# EAGLE design controllerHat (EAGLE 7.6.0)
CNAME: timebox controller; CREVISION: 1.0; DESIGNER: volzo
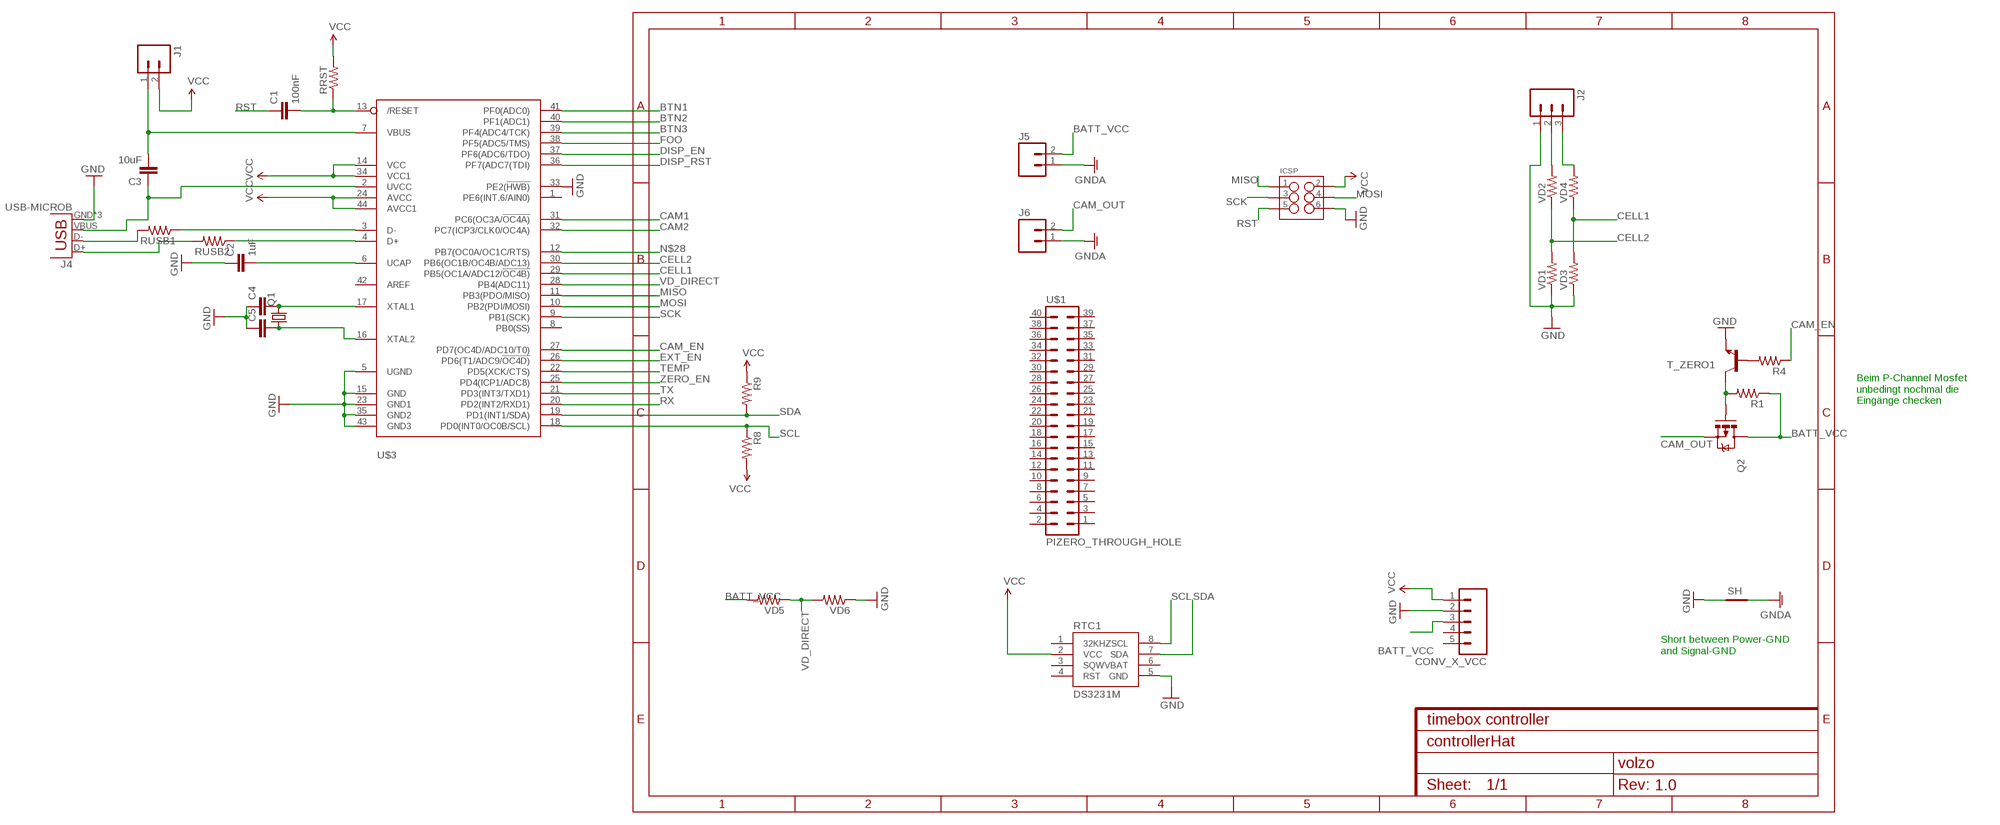
[diagram p0: schematic, sheet 1]

## Parts
C1  100nF  CAP1206  [1206]
C2  1uF  CAP1206  [1206]
C3  10uF  CAP1206  [1206]
C4  CAP1206  [1206]
C5  CAP1206  [1206]
CONV_X_VCC  M05LOCK  [1X05_LOCK]
ICSP  M03X2FEMALE  [2X3]
J1  M02LOCK  [1X02_LOCK]
J2  M03LOCK  [1X03_LOCK]
J4  USB-MICROB  [USB-MICROB]
J5  M023.5MM_LOCK  [SCREWTERMINAL-3.5MM-2_LOCK]
J6  M023.5MM_LOCK  [SCREWTERMINAL-3.5MM-2_LOCK]
Q1  CRYSTALMM20SS  [MM20SS]
Q2  MOSFET-PCHANNELNDP6020P_20V_24A_LOW_VGS_TH  [TO220V]
R1  RESISTOR1206  [1206]
R4  RESISTOR1206  [1206]
R8  RESISTOR1206  [1206]
R9  RESISTOR1206  [1206]
RRST  RESISTOR1206  [1206]
RTC1  DS3231M  [SOIC8]
RUSB1  RESISTOR1206  [1206]
RUSB2  RESISTOR1206  [1206]
SH  SHORT-HT5  [SHORT_TOP-50]
T_ZERO1  TRANSISTOR_NPN2N3904  [TO-92]
U$1  PIZERO_THROUGH_HOLE  [PIZERO_THOUGH_HOLE]
U$3  ATMEGA32U4-AU  [TQFP44]
VD1  RESISTOR1206  [1206]
VD2  RESISTOR1206  [1206]
VD3  RESISTOR1206  [1206]
VD4  RESISTOR1206  [1206]
VD5  RESISTOR1206  [1206]
VD6  RESISTOR1206  [1206]

## Nets
BATT_VCC [power]: CONV_X_VCC.3 J5.2 Q2.2(D) R1.1 VD5.2
BTN1: U$3.41(PF0(ADC0))
BTN2: U$3.40(PF1(ADC1))
BTN3: U$3.39(PF4(ADC4/TCK))
CAM1: U$3.31(PC6(OC3A/!OC4A))
CAM2: U$3.32(PC7(ICP3/CLK0/OC4A))
CAM_EN: R4.1 U$3.27(PD7(OC4D/ADC10/T0))
CAM_OUT [power]: J6.2 Q2.3(S)
CELL1: U$3.29(PB5(OC1A/ADC12/!OC4B)) VD3.2 VD4.1
CELL2: U$3.30(PB6(OC1B/OC4B/ADC13)) VD1.2 VD2.1
DISP_EN: U$3.37(PF6(ADC6/TDO))
DISP_RST: U$3.36(PF7(ADC7(TDI))
EXT_EN: U$3.26(PD6(T1/ADC9/!OC4D))
FOO: U$3.38(PF5(ADC5/TMS))
GND: C2.1 C4.1 C5.1 CONV_X_VCC.2 ICSP.6 J2.1 J4.GND J4.MT1(GND) J4.MT2(GND) RTC1.5(GND) SH.1 T_ZERO1.1(E) U$3.5(UGND) U$3.15(GND) U$3.23(GND1) U$3.33(PE2(!HWB)) U$3.35(GND2) U$3.43(GND3) VD1.1 VD3.1 VD6.1
GNDA [power]: J5.1 J6.1 SH.2
MISO: ICSP.1 U$3.11(PB3(PDO/MISO))
MOSI: ICSP.4 U$3.10(PB2(PDI/MOSI))
N$1: C1.2 RRST.1 U$3.13(/RESET)
N$2: J2.3 VD4.2
N$3: J2.2 VD2.2
N$4: RUSB1.1 U$3.3(D-)
N$5: RUSB2.1 U$3.4(D+)
N$7: R4.2 T_ZERO1.2(B)
N$8: C4.2 Q1.4 U$3.17(XTAL1)
N$9: C5.2 Q1.1 U$3.16(XTAL2)
N$10: C3.2 J1.1 U$3.7(VBUS)
N$11: J4.D- RUSB1.2
N$14: J4.D+ RUSB2.2
N$20: C2.2 U$3.6(UCAP)
N$21: Q2.1(G) R1.2 T_ZERO1.3(C)
N$22: C3.1 J4.VBUS U$3.2(UVCC)
N$28: U$3.12(PB7(OC0A/OC1C/RTS))
RST: C1.1 ICSP.5
RX: U$3.20(PD2(INT2/RXD1))
SCK: ICSP.3 U$3.9(PB1(SCK))
SCL: R8.1 RTC1.8(SCL) U$3.18(PD0(INT0/OC0B/SCL))
SDA: R9.2 RTC1.7(SDA) U$3.19(PD1(INT1/SDA))
TEMP: U$3.22(PD5(XCK/CTS))
TX: U$3.21(PD3(INT3/TXD1))
VCC: CONV_X_VCC.1 ICSP.2 J1.2 R8.2 R9.1 RRST.2 RTC1.2(VCC) U$3.14(VCC) U$3.24(AVCC) U$3.34(VCC1) U$3.44(AVCC1)
VD_DIRECT: U$3.28(PB4(ADC11)) VD5.1 VD6.2
ZERO_EN: U$3.25(PD4(ICP1/ADC8))
Unconnected: CONV_X_VCC.4 CONV_X_VCC.5 RTC1.1(32KHZ) RTC1.3(SQW) RTC1.4(RST) U$1.1 U$1.2 U$1.3 U$1.4 U$1.5 U$1.6 U$1.7 U$1.8 U$1.9 U$1.10 U$1.11 U$1.12 U$1.13 U$1.14 U$1.15 U$1.16 U$1.17 U$1.18 U$1.19 U$1.20 U$1.21 U$1.22 U$1.23 U$1.24 U$1.25 U$1.26 U$1.27 U$1.28 U$1.29 U$1.30 U$1.31 U$1.32 U$1.33 U$1.34 U$1.35 U$1.36 U$1.37 U$1.38 U$1.39 U$1.40 U$3.1(PE6(INT.6/AIN0)) U$3.8(PB0(SS)) U$3.42(AREF)

## Notes on the sheet
- Beim P-Channel Mosfet
  unbedingt nochmal die 
  Eingänge checken
- Short between Power-GND
  and Signal-GND

## Power pins joined to a net without a drawn wire
VBAT: RTC1.6(VBAT)

## Library data of the parts
C1 C3-C5 = SparkFun-Passives:CAP: Capacitor Standard 0603 ceramic capacitor, and 0.1" leaded capacitor.
C2 = SparkFun-Capacitors:CAP: Capacitor Standard 0603 ceramic capacitor, and 0.1" leaded capacitor.
CONV_X_VCC = SparkFun-Connectors:M05: Header 5 Standard 5-pin 0.1" header. Use with straight break away headers (SKU : PRT-00116), right angle break away headers (PRT-00553), swiss pins (PRT-00743), machine pins (PRT-00117), and female headers (PRT-00115). Molex polarized connector foot print use with SKU : PRT-08230 with associated crimp pins and housings.
ICSP = SparkFun-Connectors:M03X2: 2x3 .1" header. Shrouded, with keying- CONN-10681 SMT- CONN-11415 Pogo pins- HW-11044; PROD_ID: CONN-11566; VALUE: FEMALE 2x3
J1 = SparkFun-Connectors:M02: Standard 2-pin 0.1" header. Use with - straight break away headers ( PRT-00116) - right angle break away headers (PRT-00553) - swiss pins (PRT-00743) - machine pins (PRT-00117) - female headers (PRT-00115) Molex polarized connector foot print use with: PRT-08233 with associated crimp pins and housings. 2.54_SCREWTERM for use with PRT-10571. 3.5mm Screw Terminal footprints for PRT-08084 5mm Screw Terminal footprints for use with PRT-08432
J2 = SparkFun-Connectors:M03: Header 3 Standard 3-pin 0.1" header. Use with straight break away headers (SKU : PRT-00116), right angle break away headers (PRT-00553), swiss pins (PRT-00743), machine pins (PRT-00117), and female headers (PRT-00115). Molex polarized connector foot print use with SKU : PRT-08232 with associated crimp pins and housings.
J4 = SparkFun-Connectors:USB: USB Connectors USB-B-PTH is fully proven SKU : PRT-00139/CONN-08278 USB-miniB is fully proven SKU : PRT-00587 USB-A-PCB is untested. USB-A-H is throughly reviewed, but untested. Spark Fun Electronics SKU : PRT-00437 USB-B-SMT is throughly reviewed, but untested. Needs silkscreen touching up. USB-A-S has not been used/tested USB-MB-H has not been used/tested USB-MICROB has been used. CONN-09505; PROD_ID: CONN-09505
J5 J6 = SparkFun-Connectors:M02: Standard 2-pin 0.1" header. Use with - straight break away headers ( PRT-00116) - right angle break away headers (PRT-00553) - swiss pins (PRT-00743) - machine pins (PRT-00117) - female headers (PRT-00115) Molex polarized connector foot print use with: PRT-08233 with associated crimp pins and housings. 2.54_SCREWTERM for use with PRT-10571. 3.5mm Screw Terminal footprints for PRT-08084 5mm Screw Terminal footprints for use with PRT-08432; PROD_ID: CONN-08399
Q1 = adafruit:CRYSTAL: CRYSTAL; OC_FARNELL: unknown; OC_NEWARK: unknown
Q2 = SparkFun-DiscreteSemi:MOSFET-PCHANNEL: Generic PMOSFET IRLML2244 - TRANS-11153 (SOT-23 -20V -4.3A) (1.Gate 2.Source 3.Drain) FQP27P06 - COM-10349 <http://www.sparkfun.com/products/10349> (TO-220 -60V -27A) (1.Gate 2.Source 3.Drain); PROD_ID: TRANS-13060
R1 R4 R8 R9 RRST RUSB1 RUSB2 VD1-VD6 = SparkFun-Passives:RESISTOR: Resistor Basic schematic elements and footprints for 0603, 1206, and PTH resistors.
RTC1 = SparkFun-DigitalIC:DS3231M: DS3231M Real Time Clock. Accuracy +/-5ppm. Battery Backup. 2.3V to 5.5V.; PROD_ID: IC-11985
SH = shorts-old:SHORT-H: Short between two nets; BOM: no
T_ZERO1 = SparkFun-DiscreteSemi:TRANSISTOR_NPN: Generic NPN BJT MMBT2222A - TRANS-08049 (SOT-23, 1A 40V) MPSA42 - TRANS-09116 (SOT-23, 500mA 300V) MMBT5088LT1G - TRANS-11160 (SOT-23, 50 mA 30V) BC547 - COM-08928 <http://www.sparkfun.com/products/8928> (TO-92 45V 100mA) (1.Collector 2.Base 3.Emitter) 2N3904 - COM-00521 <http://www.sparkfun.com/products/521> (TO-92 40V 200mA) (1.Emitter 2.Base 3.Collector) P2N2222A - COM-12852 <http://www.sparkfun.com/products/12852> (TO-92 40V 600mA) (1.Collector 2.Base 3.Emitter); PROD_ID: TRANS-08447
U$1 = pizero:PIZERO_THROUGH_HOLE
U$3 = adafruit:ATMEGA32U4: http://www.ladyada.net/library/eagle

## Net classes
0 default: width 0.254 mm
1 power: width 0.762 mm, clearance 0.254 mm

## Board
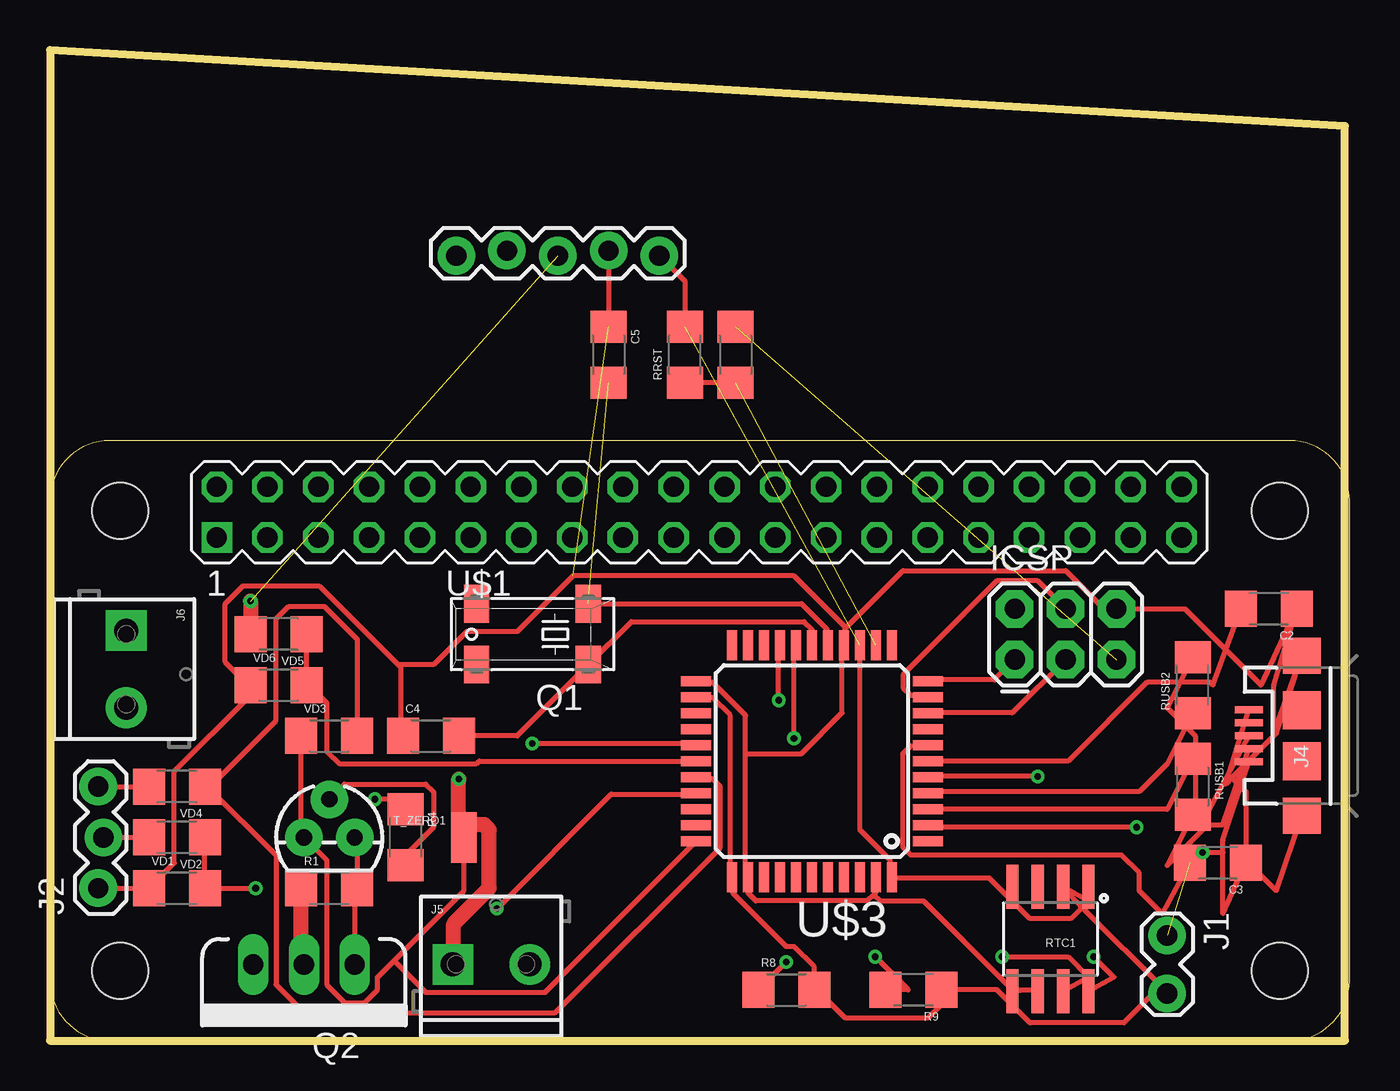
[diagram p1: board, top side]
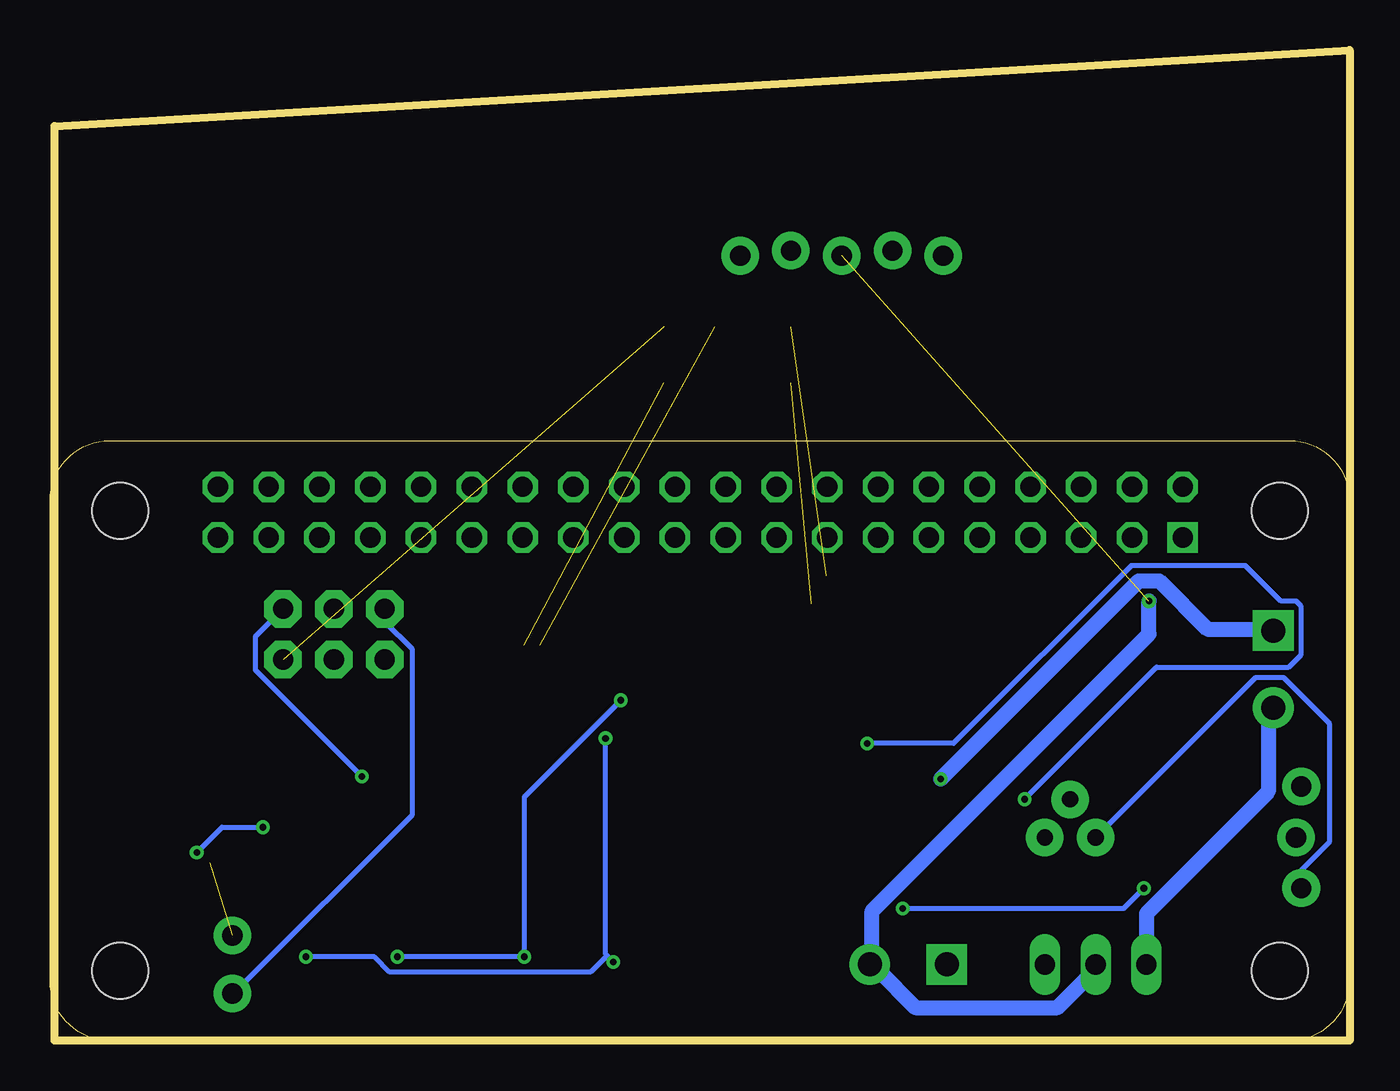
[diagram p2: board, bottom side, seen from below]

Size 64.77 x 49.53 mm. Coordinates in mm from the lower left corner, seen from the top.
Outline: 0,0 64.77,0 64.77,45.72 0,49.53 0,0
Copper layers (1*16): Top 0.0356mm / dielectric 1.5011mm / Bottom 0.0356mm
Design rules "oshpark-2layer *": minimum track width 6mil, minimum drill 13mil, track to track 10mil, track to pad 10mil, pad to pad 10mil, via to via 10mil, smd to smd 10mil, copper to edge 15mil, drill to drill 6mil, minimum pad ring 7mil, minimum via ring 7mil, stop-mask expansion 2.5mil, vias tented up to drill 0mil, thermal gap 10mil

### Footprints (pad centres in the part's own frame; a part is rotated, then mirrored left to right if it is on the bottom)
1206 = smd 1.6 x 1.8: 1 -1.4,0; 2 1.4,0
1X05_LOCK = drill 1.016 pad 1.88: 1 0,0.127; 2 2.54,-0.127; 3 5.08,0.127; 4 7.62,-0.127; 5 10.16,0.127
2X3 = drill 1.016 pad 1.88 octagon: 1 0,0; 2 0,2.54; 3 2.54,0; 4 2.54,2.54; 5 5.08,0; 6 5.08,2.54
1X02_LOCK = drill 1.016 pad 1.88: 1 -0.178,0; 2 2.718,0
1X03_LOCK = drill 1.016 pad 1.88: 1 0,0.127; 2 2.54,-0.127; 3 5.08,0.127
USB-MICROB = smd 0.35 x 1.4: D+ 0,2.65; D- -0.65,2.65; GND 1.3,2.65; ID 0.65,2.65; VBUS -1.3,2.65 | smd 1.8 x 1.9: MT1 -4,0; MT2 4,0 | smd 1.9 x 1.9: P$1 -1.27,0; P$2 1.27,0
SCREWTERMINAL-3.5MM-2_LOCK = drill 1.2 pad 2.032 square: 1 -0.178,0 | drill 1.2 pad 2.032: 2 3.678,0
MM20SS = smd 1.27 x 1.88: 1 -2.794,-1.524; 2 2.794,-1.524; 3 2.794,1.524; 4 -2.794,1.524
TO220V = drill 1.016 long: 1 -2.54,0; 2 0,0; 3 2.54,0
SOIC8 = smd 0.61 x 2.21: 1 -1.905,-2.616; 2 -0.635,-2.616; 3 0.635,-2.616; 4 1.905,-2.616; 5 1.905,2.616; 6 0.635,2.616; 7 -0.635,2.616; 8 -1.905,2.616
SHORT_TOP-50 = smd 1.27 x 1.27: 1 0.635,0; 2 -0.635,0
TO-92 = drill 0.813 pad 1.88: 1 -1.27,0; 2 0,1.905; 3 1.27,0
PIZERO_THOUGH_HOLE = drill 1.016 square: 1 8.34,25.15 | drill 1.016 octagon: 2 8.34,27.69; 3 10.88,25.15; 4 10.88,27.69; 5 13.42,25.15; 6 13.42,27.69; 7 15.96,25.15; 8 15.96,27.69; 9 18.5,25.15; 10 18.5,27.69; 11 21.04,25.15; 12 21.04,27.69; 13 23.58,25.15; 14 23.58,27.69; 15 26.12,25.15; 16 26.12,27.69; 17 28.66,25.15; 18 28.66,27.69; 19 31.2,25.15; 20 31.2,27.69; 21 33.74,25.15; 22 33.74,27.69; 23 36.28,25.15; 24 36.28,27.69; 25 38.82,25.15; 26 38.82,27.69; 27 41.36,25.15; 28 41.36,27.69; 29 43.9,25.15; 30 43.9,27.69; 31 46.44,25.15; 32 46.44,27.69; 33 48.98,25.15; 34 48.98,27.69; 35 51.52,25.15; 36 51.52,27.69; 37 54.06,25.15; 38 54.06,27.69; 39 56.6,25.15; 40 56.6,27.69 | hole 2.8: 3.5,3.5; 3.5,26.5; 61.5,26.5; 61.5,3.5
TQFP44 = smd 1.5 x 0.5: 1 -5.8,4; 2 -5.8,3.2; 3 -5.8,2.4; 4 -5.8,1.6; 5 -5.8,0.8; 6 -5.8,0; 7 -5.8,-0.8; 8 -5.8,-1.6; 9 -5.8,-2.4; 10 -5.8,-3.2; 11 -5.8,-4; 23 5.8,-4; 24 5.8,-3.2; 25 5.8,-2.4; 26 5.8,-1.6; 27 5.8,-0.8; 28 5.8,0; 29 5.8,0.8; 30 5.8,1.6; 31 5.8,2.4; 32 5.8,3.2; 33 5.8,4 | smd 0.5 x 1.5: 12 -4,-5.8; 13 -3.2,-5.8; 14 -2.4,-5.8; 15 -1.6,-5.8; 16 -0.8,-5.8; 17 0,-5.8; 18 0.8,-5.8; 19 1.6,-5.8; 20 2.4,-5.8; 21 3.2,-5.8; 22 4,-5.8; 34 4,5.8; 35 3.2,5.8; 36 2.4,5.8; 37 1.6,5.8; 38 0.8,5.8; 39 0,5.8; 40 -0.8,5.8; 41 -1.6,5.8; 42 -2.4,5.8; 43 -3.2,5.8; 44 -4,5.8

### Placement (x,y rotation side)
C1  34.29,34.29 270 top
C2  60.96,21.59 180 top
C3  58.42,8.89 180 top
C4  19.05,15.24 0 top
C5  27.94,34.29 270 top
CONV_X_VCC  30.48,39.37 180 top
ICSP  48.26,19.05 0 top
J1  55.88,5.08 270 top
J2  2.54,7.62 90 top
J4  62.61,15.24 90 top
J5  20.32,3.81 0 top
J6  3.81,20.32 270 top
Q1  24.13,20.32 180 top
Q2  12.7,3.81 180 top
R1  13.97,7.62 0 top
R4  17.78,10.16 270 top
R8  36.83,2.54 0 top
R9  43.18,2.54 180 top
RRST  31.75,34.29 90 top
RTC1  50.04,5.08 180 top
RUSB1  57.15,12.7 270 top
RUSB2  57.15,17.78 90 top
SH  20.7,10.16 270 top
T_ZERO1  13.97,10.16 0 top
U$1  0,0 0 top
U$3  38.1,13.97 180 top
VD1  6.35,7.62 0 top
VD2  6.35,10.16 180 top
VD3  13.97,15.24 0 top
VD4  6.35,12.7 180 top
VD5  11.43,20.32 180 top
VD6  11.43,17.78 0 top

### Tracks (layer width: path | path; a pad name or v marks a point on that pad's centre or on a via)
BATT_VCC  (via drill 0.33)  (1 unrouted)
  Top 0.762: Q2.2 12.57,3.94 R1.1 | v10.03,21.97 VD5.2
  Bottom 0.762: v10.03,21.97 VD5.2 23.88,6.48 23.88,3.81 J5.2 23.62,3.56 21.72,1.65 14.61,1.65 12.7,3.56 Q2.2
CAM_EN  (via drill 0.33)
  Top 0.254: v24.13,14.86 32.26,14.86 U$3.27 | v16.26,12.06 17.4,12.06 17.78,11.68 R4.1
  Bottom 0.254: v24.13,14.86 19.81,14.86 10.92,23.75 5.21,23.75 3.43,21.97 2.67,21.97 2.41,21.72 2.41,19.3 3.05,18.67 9.65,18.67 v16.26,12.06
CAM_OUT
  Bottom 0.762: Q2.3 10.16,6.35 4.06,12.45 4.06,16.38 J6.2
CELL1
  Top 0.254: U$3.29 32.38,13.08 33.15,13.08 33.53,12.7 33.53,9.65 25.27,1.4 12.7,1.4 11.3,2.79 11.3,9.27 7.87,12.7 VD4.1 8,12.7 11.3,16 11.3,21.08 11.94,21.72 13.72,21.72 15.37,20.07 VD3.2
CELL2  (via drill 0.33)
  Top 0.254: v22.35,6.6 28.07,12.32 32.26,12.32 U$3.30 | v10.29,7.62 VD1.2 VD2.1
  Bottom 0.254: v22.35,6.6 11.3,6.6 v10.29,7.62
GND  (via drill 0.33)  (1 unrouted)
  Top 0.254: J2.1 VD1.1 6.22,8.89 6.22,13.46 9.91,17.14 9.91,17.78 | 17.46,18.73 13.46,22.73 9.65,22.73 8.76,21.84 8.76,18.92 9.91,17.78 | 17.46,18.73 17.53,18.67 17.53,15.24 C4.1 | 9.91,17.78 VD6.1 | SH.1 20.7,7.49 17.21,4 | 17.21,4 16.38,3.17 16.38,2.54 15.75,1.91 14.73,1.91 13.84,2.79 13.84,9.02 T_ZERO1.1 12.57,10.29 VD3.1 | 17.21,4 18.8,2.41 24.77,2.41 32.26,9.91 U$3.33 | 59.12,13.14 61.34,15.37 J4.MT2 61.21,15.37 61.21,17.78 C2.1 60.58,17.78 56.77,21.59 ICSP.6 52.7,21.59 50.8,23.5 42.67,23.5 39.81,20.64 | 59.12,13.14 58.8,12.83 J4.GND | 59.12,13.14 59.82,12.45 59.82,9.02 61.34,7.49 J4.MT1 | v49.4,13.21 43.94,13.21 U$3.5 | 41.21,7.3 41.27,7.37 41.27,8.13 U$3.43 | 41.21,7.3 40.89,6.99 35.31,6.99 34.92,7.37 34.92,8.13 U$3.35 34.8,8.26 34.8,14.35 | 34.8,14.35 34.8,16.26 33.15,17.91 32.38,17.91 U$3.23 | 34.8,14.35 37.59,14.35 39.62,16.38 39.62,19.68 U$3.15 39.75,19.81 39.75,20.57 39.81,20.64 | 41.21,7.3 41.53,6.99 43.69,6.99 48.13,2.54 49.4,2.54 RTC1.5 | 39.81,20.64 37.21,23.24 26.16,23.24 23.37,20.45 20.83,20.45 19.18,18.8 17.53,18.8 17.46,18.73 | CONV_X_VCC.2 C5.1
  Bottom 0.254: J2.1 2.41,8.51 1.02,9.91 1.02,15.88 3.3,18.16 4.7,18.16 T_ZERO1.1 | v49.4,13.21 54.74,18.54 54.74,20.19 ICSP.6
GNDA  (via drill 0.33)
  Top 0.762: J5.1 20.19,3.81 20.19,5.84 21.97,7.62 21.97,10.54 21.72,10.79 SH.2 20.45,11.05 v20.45,13.08
  Bottom 0.762: v20.45,13.08 10.54,22.99 9.53,22.99 7.11,20.57 3.81,20.57 J6.1
MISO
  Top 0.254: ICSP.1 47.24,18.03 43.94,18.03 U$3.11
MOSI
  Top 0.254: ICSP.4 49.4,22.99 47.37,22.99 42.67,18.29 42.67,17.65 43.05,17.27 43.81,17.27 U$3.10
N$1  (1 unrouted)
  Top 0.254: RRST.1 C1.2
N$2
  Top 0.254: J2.3 VD4.2
N$3
  Top 0.254: J2.2 VD2.2
N$4
  Top 0.254: U$3.3 43.94,11.56 55.88,11.56 RUSB1.1
N$5
  Top 0.254: U$3.4 43.94,12.45 54.48,12.45 55.88,13.84 RUSB2.1
N$7
  Top 0.254: R4.2 17.78,9.27 19.18,10.67 19.18,12.45 18.8,12.83 14.73,12.83 T_ZERO1.2
N$8
  Top 0.254: U$3.17 38.1,20.57 37.72,20.95 29.08,20.95 Q1.4 23.37,15.24 C4.2
N$9  (1 unrouted)
  Top 0.254: Q1.1 37.59,21.84 38.86,20.57 38.86,19.81 U$3.16
N$10  (1 unrouted)
  Top 0.254: U$3.7 43.81,14.73 43.05,14.73 42.67,14.35 42.67,9.65 43.05,9.27 53.59,9.27 54.48,8.38 54.48,7.49 55.63,6.35 C3.2
N$11
  Top 0.254: J4.D- 58.67,10.79 57.91,10.79 55.88,8.76 RUSB1.2
N$14
  Top 0.254: J4.D+ 57.91,11.43 57.28,12.06 57.28,15.24 55.88,16.64 RUSB2.2
N$20
  Top 0.254: U$3.6 50.93,13.97 54.86,17.91 58.04,17.91 58.17,17.78 C2.2
N$21
  Top 0.254: R1.2 15.37,10.03 T_ZERO1.3 | Q2.1 15.24,7.49 R1.2 | R1.2
N$22  (via drill 0.33)
  Top 0.254: 58.67,9.4 58.67,6.35 C3.1 | 58.67,9.4 58.67,10.03 J4.VBUS | v54.36,10.67 43.94,10.67 U$3.2 | 58.67,9.4 v57.66,9.4
  Bottom 0.254: v54.36,10.67 56.39,10.67 v57.66,9.4
RST  (1 unrouted)
SCK
  Top 0.254: ICSP.3 48.13,16.38 43.94,16.38 U$3.9
SCL  (via drill 0.33)
  Top 0.254: v37.21,15.11 37.21,19.68 U$3.18 | v36.83,3.94 R8.1 | RTC1.8 53.21,3.17 v52.2,4.19
  Bottom 0.254: v37.21,15.11 37.21,4.32 37.15,4.25 | v36.83,3.94 37.15,4.25 | v52.2,4.19 48.77,4.19 48.01,3.43 37.97,3.43 37.15,4.25
SDA  (via drill 0.33)
  Top 0.254: v36.45,17.02 36.45,19.68 U$3.19 | v41.27,4.19 42.93,2.54 R9.2 | RTC1.7 51.94,3.17 50.93,4.19 v47.62,4.19
  Bottom 0.254: v36.45,17.02 41.27,12.19 v41.27,4.19 v47.62,4.19
VCC  (1 unrouted)
  Top 0.254: U$3.24 32.38,17.14 33.15,17.14 34.04,16.26 34.04,8.26 U$3.34 34.16,8.13 34.16,7.37 36.83,4.7 37.21,4.7 38.23,3.68 R8.2 38.35,2.54 39.75,1.14 43.94,1.14 45.34,2.54 R9.1 47.37,2.54 49.02,0.89 53.72,0.89 55.5,2.67 J1.2 55.75,2.54 51.69,6.6 RTC1.2 51.94,6.99 51.05,6.1 49.02,6.1 46.99,8.13 42.16,8.13 U$3.44 42.04,8.26 42.04,9.02 40.51,10.54 40.51,19.68 U$3.14 | RRST.2 31.75,37.97 CONV_X_VCC.1
  Bottom 0.254: ICSP.2 48.26,20.95 46.86,19.56 46.86,11.3 55.63,2.54 J1.2
VD_DIRECT
  Top 0.254: U$3.28 21.46,13.97 21.34,13.84 14.48,13.84 13.84,14.48 13.84,16.89 12.95,17.78 VD6.2 VD5.1